# EAGLE design guhPLC_6LowPANModule (EAGLE 6.1)
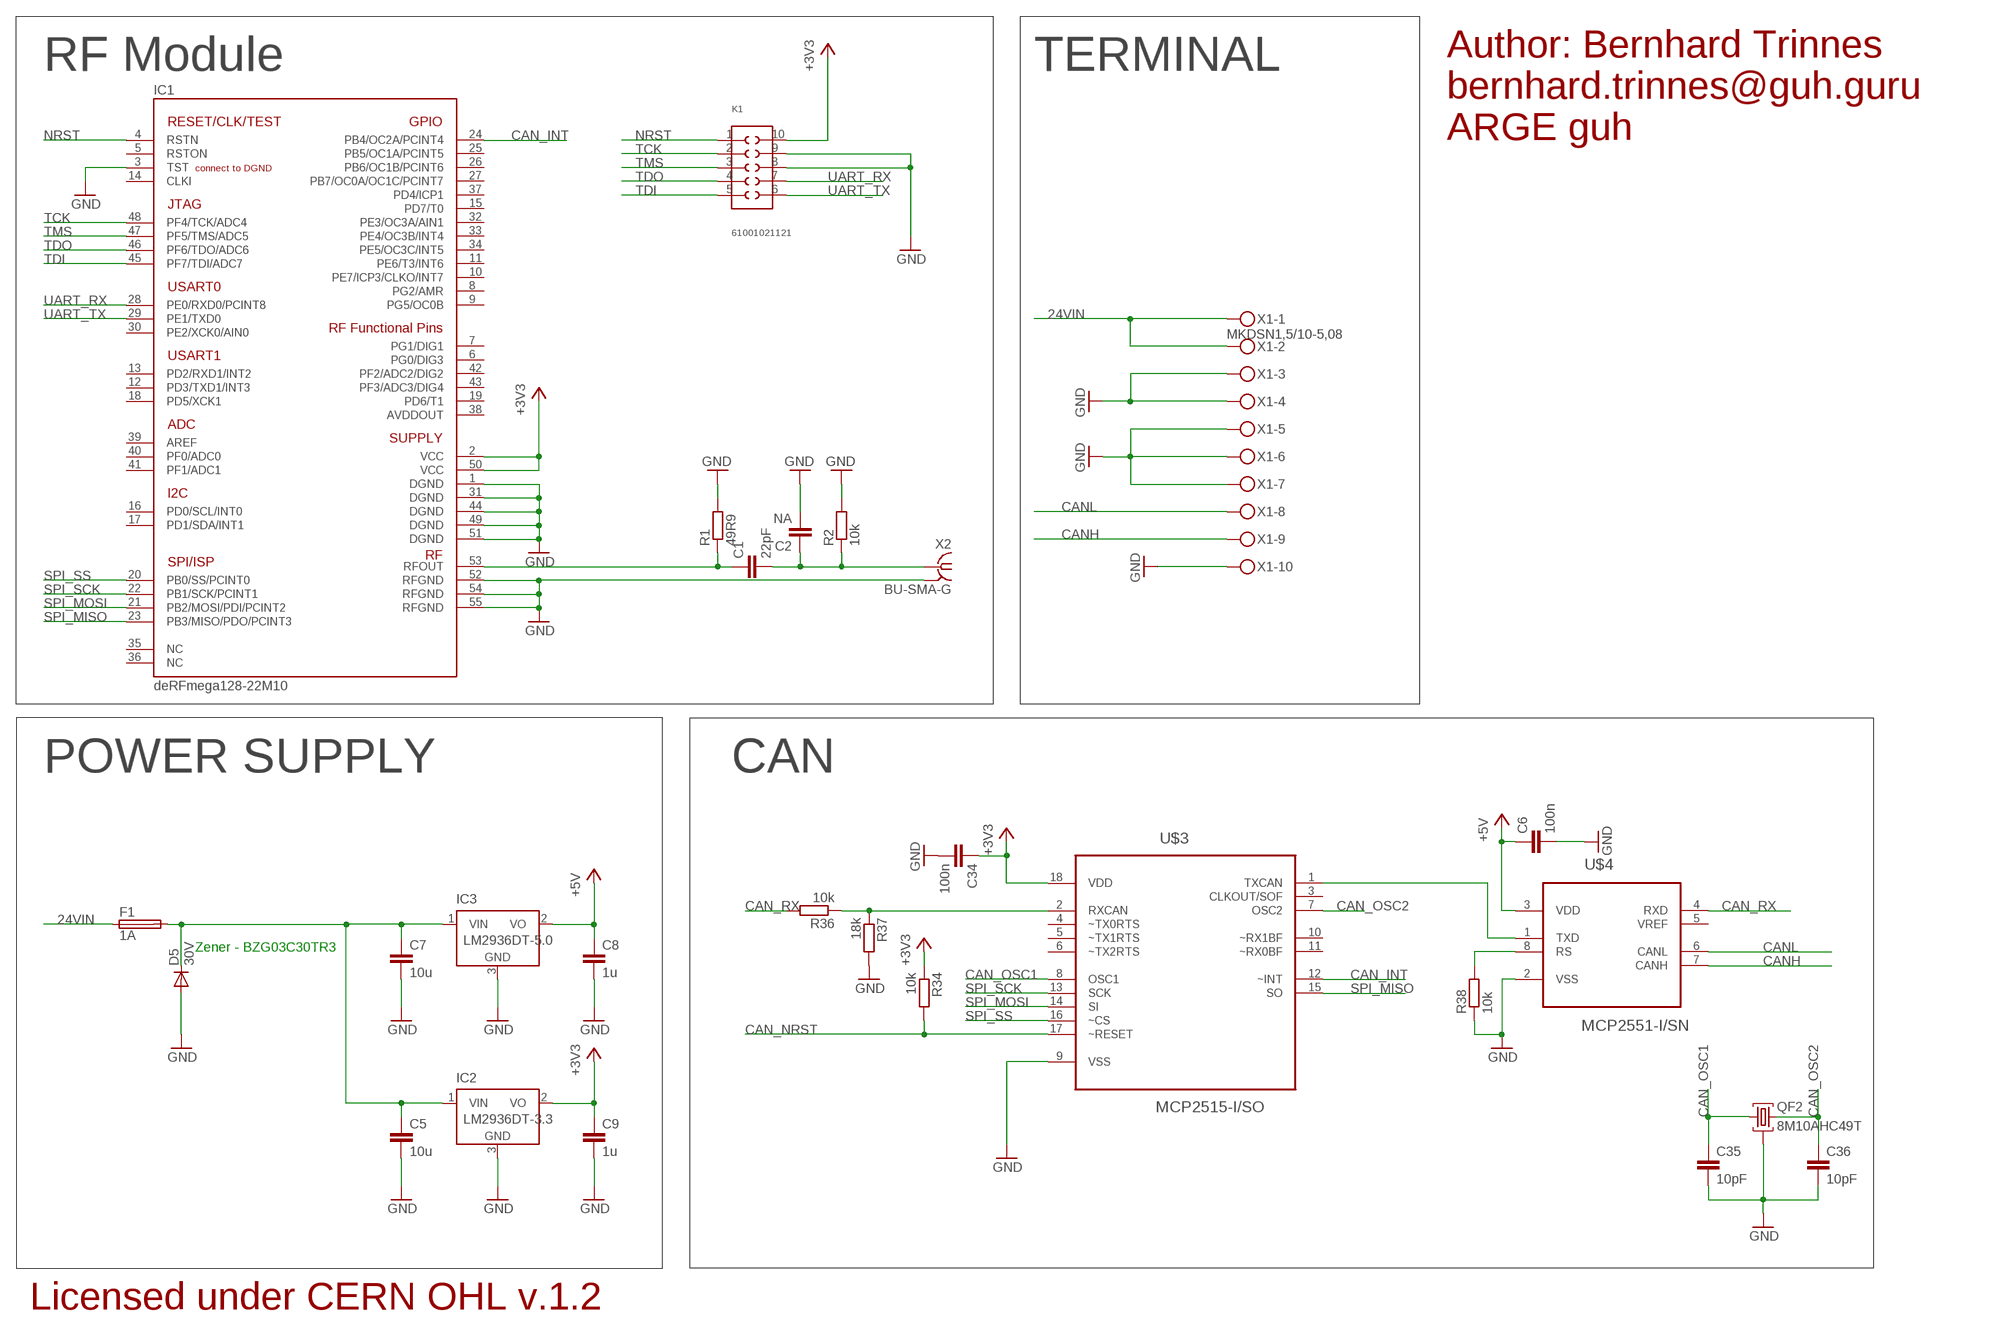
[diagram p0: schematic, sheet 1]

## Parts
C1  22pF  C-EUC0402  [C0402]
C2  NA  C-EUC0402  [C0402]
C5  10u  C-EUC1206  [C1206]
C6  100n  C-EUC0603  [C0603]
C7  10u  C-EUC1206  [C1206]
C8  1u  C-EUC0603  [C0603]
C9  1u  C-EUC0603  [C0603]
C34  100n  C-EUC0603  [C0603]
C35  10pF  C-EUC0603  [C0603]
C36  10pF  C-EUC0603  [C0603]
D5  30V  DIODE-DO214AC  [DO214AC]
F1  1A  LITTLEFUSE  [LITTLEFUSE]
IC1  DERFMEGA128-22M10  [A-M10]
IC2  LM2936DT-3.3  [TO252]
IC3  LM2936DT-5.0  [TO252]
K1  61001021121  [61001021121]
QF2  8M10AHC49T  [HC49U]
R1  49R9  R-EU_R0402  [R0402]
R2  10k  R-EU_R0402  [R0402]
R34  10k  R-EU_R0603  [R0603]
R36  10k  R-EU_R0603  [R0603]
R37  18k  R-EU_R0603  [R0603]
R38  10k  R-EU_R0603  [R0603]
U$3  MCP2515-I/SO  [SOIC127P1034X264-18N]
U$4  MCP2551-I/SN  [SOIC127P600X175-8N]
X1  MKDSN1,5/10-5,08  [MKDSN1,5/10-5,08]
X2  BU-SMA-G  [BU-SMA-G]

## Nets
24VIN: F1.1 X1.1 X1.2
+3V3: C9.1 C34.1 IC1.2(VCC) IC1.50(VCC) IC2.2(VO) K1.10 R34.1 U$3.18(VDD)
+5V: C6.1 C8.1 IC3.2(VO) U$4.3(VDD)
CAN_INT: IC1.24(PB4/OC2A/PCINT4) U$3.12(~INT)
CAN_NRST: R34.2 U$3.17(~RESET)
CAN_OSC1: C35.1 QF2.1 U$3.8(OSC1)
CAN_OSC2: C36.1 QF2.3 U$3.7(OSC2)
CAN_RX: R36.2 U$4.4(RXD)
CANH: U$4.7(CANH) X1.9
CANL: U$4.6(CANL) X1.8
GND [gnd]: C2.2 C5.2 C6.2 C7.2 C8.2 C9.2 C34.2 C35.2 C36.2 D5.A IC1.1(DGND) IC1.3(TST) IC1.31(DGND) IC1.44(DGND) IC1.49(DGND) IC1.51(DGND) IC1.52(RFGND) IC1.54(RFGND) IC1.55(RFGND) IC2.3(GND) IC3.3(GND) K1.8 K1.9 QF2.2 R1.2 R2.2 R37.2 R38.1 U$3.9(VSS) U$4.2(VSS) X1.3 X1.4 X1.5 X1.6 X1.7 X1.10 X2.2(GND)
N$1: C1.2 C2.1 R2.1 X2.1
N$20: U$3.1(TXCAN) U$4.1(TXD)
N$22: R36.1 R37.1 U$3.2(RXCAN)
N$24: R38.2 U$4.8(RS)
NRST: IC1.4(RSTN) K1.1
RFOUT: C1.1 IC1.53(RFOUT) R1.1
SPI_MISO: IC1.23(PB3/MISO/PDO/PCINT3) U$3.15(SO)
SPI_MOSI: IC1.21(PB2/MOSI/PDI/PCINT2) U$3.14(SI)
SPI_SCK: IC1.22(PB1/SCK/PCINT1) U$3.13(SCK)
SPI_SS: IC1.20(PB0/SS/PCINT0) U$3.16(~CS)
TCK: IC1.48(PF4/TCK/ADC4) K1.2
TDI: IC1.45(PF7/TDI/ADC7) K1.5
TDO: IC1.46(PF6/TDO/ADC6) K1.4
TMS: IC1.47(PF5/TMS/ADC5) K1.3
UART_RX: IC1.28(PE0/RXD0/PCINT8) K1.7
UART_TX: IC1.29(PE1/TXD0) K1.6
VCC [power]: C5.1 C7.1 D5.C F1.2 IC2.1(VIN) IC3.1(VIN)
Unconnected: IC1.5(RSTON) IC1.6(PG0/DIG3) IC1.7(PG1/DIG1) IC1.8(PG2/AMR) IC1.9(PG5/OC0B) IC1.10(PE7/ICP3/CLKO/INT7) IC1.11(PE6/T3/INT6) IC1.12(PD3/TXD1/INT3) IC1.13(PD2/RXD1/INT2) IC1.14(CLKI) IC1.15(PD7/T0) IC1.16(PD0/SCL/INT0) IC1.17(PD1/SDA/INT1) IC1.18(PD5/XCK1) IC1.19(PD6/T1) IC1.25(PB5/OC1A/PCINT5) IC1.26(PB6/OC1B/PCINT6) IC1.27(PB7/OC0A/OC1C/PCINT7) IC1.30(PE2/XCK0/AIN0) IC1.32(PE3/OC3A/AIN1) IC1.33(PE4/OC3B/INT4) IC1.34(PE5/OC3C/INT5) IC1.35(NC) IC1.36(NC) IC1.37(PD4/ICP1) IC1.38(AVDDOUT) IC1.39(AREF) IC1.40(PF0/ADC0) IC1.41(PF1/ADC1) IC1.42(PF2/ADC2/DIG2) IC1.43(PF3/ADC3/DIG4) U$3.3(CLKOUT/SOF) U$3.4(~TX0RTS) U$3.5(~TX1RTS) U$3.6(~TX2RTS) U$3.10(~RX1BF) U$3.11(~RX0BF) U$4.5(VREF)

## Notes on the sheet
- Author: Bernhard Trinnes
- RF Module | TERMINAL
- bernhard.trinnes@guh.guru
- ARGE guh
- POWER SUPPLY | CAN
- Zener - BZG03C30TR3
- Licensed under CERN OHL v.1.2

## Power pins joined to a net without a drawn wire
GND: X2.3(GND) X2.4(GND) X2.5(GND)

## Library data of the parts
C1 C2 C5-C9 C34-C36 = resistor:C-EU: CAPACITOR, European symbol
D5 = diode:DIODE-: DIODE
F1 = fuse:LITTLEFUSE: LITTLEFUSE Picofuse/slow Littlefuse; OC_FARNELL: unknown; OC_NEWARK: unknown
IC1 = deRFmodules:DERFMEGA128-22M10: deRFmega128 IEEE 802.15.4 Low Power Wireless Radio Module Microcontroller: Atmel ATmega128RFA1 Transceiver: integrated Manufacturer: dresden elektronik ingenieurtechnik gmbh Website: http://www.dresden-elektronik.de
IC2 = national-semiconductor:LM2936?*: Ultra-Low Quiescent Current LDO Voltage Regulator Source: Data sheet <http://www.national.com/ds/LM/LM2936.pdf>; MPN: LM2936DT-3.3.; OC_FARNELL: 1286863; OC_NEWARK: 26M0361
IC3 = national-semiconductor:LM2936?*: Ultra-Low Quiescent Current LDO Voltage Regulator Source: Data sheet <http://www.national.com/ds/LM/LM2936.pdf>; MF: NATIONAL SEMICONDUCTOR; MPN: LM2936DT-5.0/NOPB; OC_FARNELL: 1286864; OC_NEWARK: 41K4501
K1 = EagleLibrary_Wuerth_Elektronik_eiCan_Board_to_Board_Connectors_v6_20150113:61001021121: WR-PHD 2.54mm Dual SMT Pin Header, 10 Pins =>Code : Con_BTB_PHD_2.54_2_61001021121 <http://katalog.we-online.de/media/images/eican/Con_BTB_PHD_2.54_2_6100xx21121_pf2.jpg> Details see: http://katalog.we-online.de/en/em/610_0xx_211_21 Created 2014-05-29, Karrer Zheng 2014 (C) Würth Elektronik
QF2 = crystal:8M10AHC49T: Monolithic Crystal Filters Source: www.vanlong.com; OC_FARNELL: unknown; OC_NEWARK: unknown
R1 R2 R34 R36-R38 = resistor:R-EU_: RESISTOR, European symbol
U$3 = guh:MCP2515-I/SO: CAN Controller; MPN: MCP2515-I/SO; OC_FARNELL: 1292239; OC_NEWARK: 29H7136; PACKAGE: SOIC-18; SUPPLIER: Microchip
U$4 = guh:MCP2551-I/SN: High-Speed CAN Transceiver; MPN: MCP2551-I/SN; OC_FARNELL: 9758569; OC_NEWARK: 69K7604; PACKAGE: SOIC-8; SUPPLIER: Microchip
X1 = con-phoenix-508:MKDSN1,5/10-5,08: MKDSN 1,5/10-5,08 Printklemme Nennstrom: 13,5 A Nennspannung: 250 V Rastermaß: 5,08 mm Polzahl: 10 Anschlussart: Schraubanschluss Montage: Löten Anschlussrichtung Leiter/Platine: 0 ° Artikelnummer: 1729209 Source: http://eshop.phoenixcontact.com .. 1729209.pdf; MPN: SMKDSN1,5/10-5,08; OC_FARNELL: 1792913; OC_NEWARK: 70R0297
X2 = con-coax:BU-SMA-G: FEMALE SMA CONNECTOR Radiall distributor RS 193-9117; OC_FARNELL: unknown; OC_NEWARK: unknown

## Net classes
0 default: width 0.254 mm, clearance 0.254 mm
1 power: width 0.61 mm, drill 0.61 mm, clearance 0.254 mm
2 gnd: width 0.305 mm, drill 0.559 mm, clearance 0.254 mm

## Board
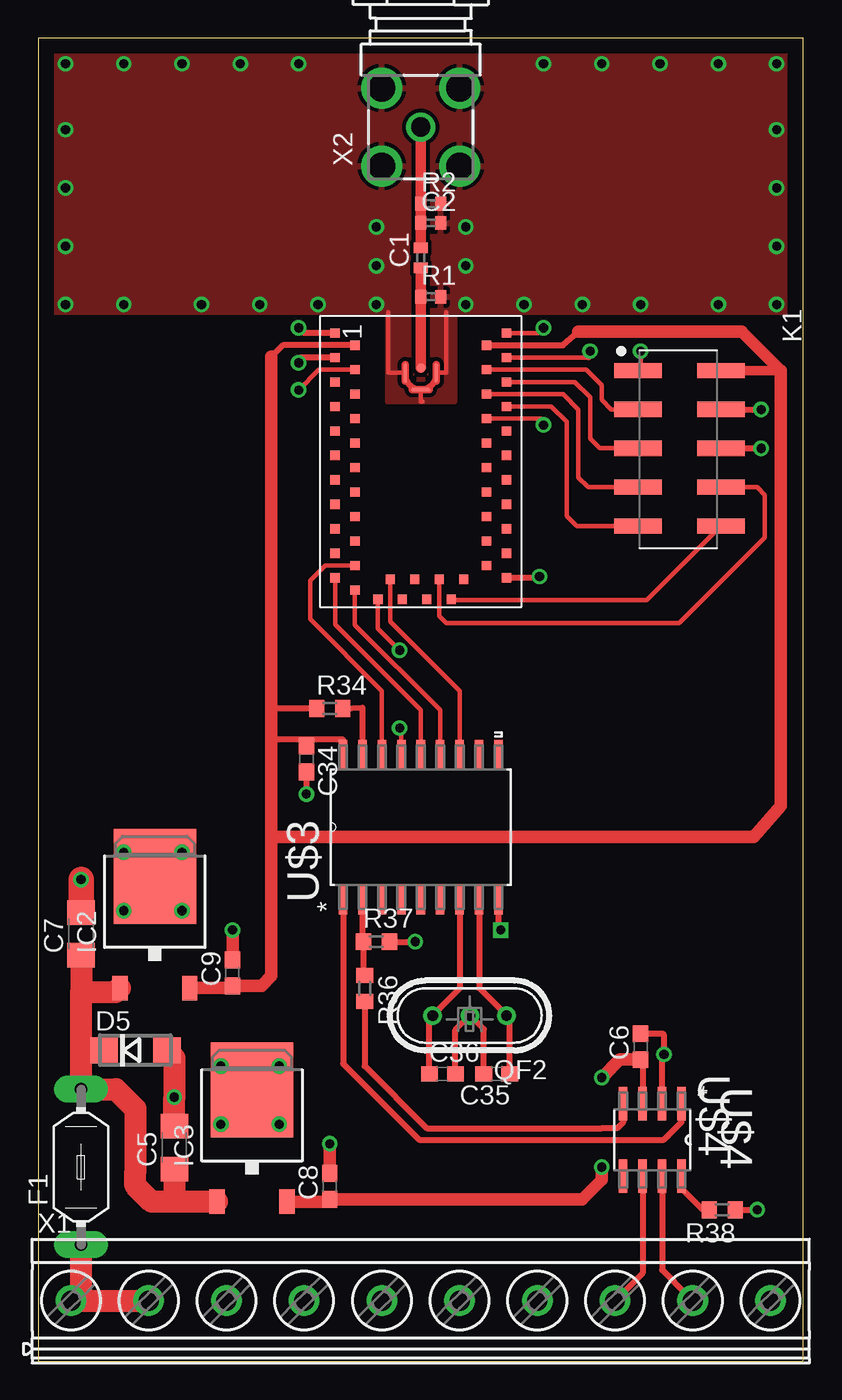
[diagram p1: board, top side]
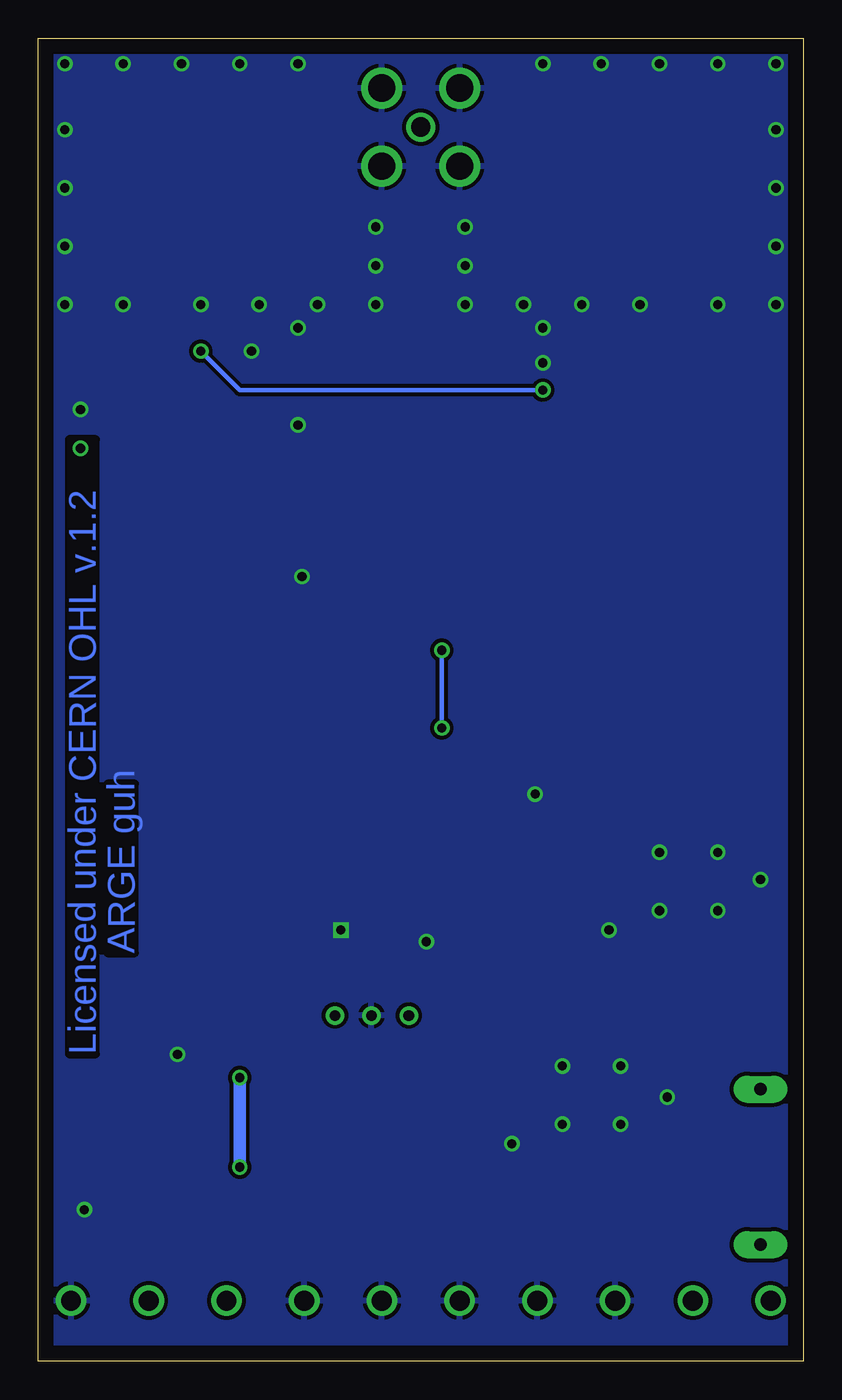
[diagram p2: board, bottom side, seen from below]

Size 50 x 86.5 mm. Coordinates in mm from the lower left corner, seen from the top.
Outline: 0,0 50,0 50,86.5 0,86.5 0,0
Copper layers (1*16): Top 0.035mm / dielectric 1.5mm / Bottom 0.035mm
Design rules: minimum track width 10mil, minimum drill 24mil, track to track 8mil, track to pad 8mil, pad to pad 8mil, via to via 8mil, smd to smd 8mil, copper to edge 40mil, drill to drill 8mil, minimum pad ring 10mil, minimum via ring 8mil, stop-mask expansion 4mil, vias tented up to drill 0mil, thermal gap 10mil

### Footprints (pad centres in the part's own frame; a part is rotated, then mirrored left to right if it is on the bottom)
C0402 = smd 0.7 x 0.9: 1 -0.65,0; 2 0.65,0
C1206 = smd 1.6 x 1.8: 1 -1.4,0; 2 1.4,0
C0603 = smd 1.1 x 1: 1 -0.85,0; 2 0.85,0
DO214AC = smd 1.8 x 1.7: A 2.05,0; C -2.05,0
LITTLEFUSE = drill 0.813 pad 1.778 long: 1 -5.08,0; 2 5.08,0
A-M10 = smd 0.6 x 0.6: 1 -8.4,-5.6; 2 -7.6,-4.3; 3 -6.8,-5.6; 4 -6,-4.3; 5 -5.2,-5.6; 6 -4.4,-4.3; 7 -3.6,-5.6; 8 -2.8,-4.3; 9 -2,-5.6; 10 -1.2,-4.3; 11 -0.4,-5.6; 12 0.4,-4.3; 13 1.2,-5.6; 14 2,-4.3; 15 2.8,-5.6; 16 3.6,-4.3; 17 4.4,-5.6; 18 5.2,-4.3; 19 6,-5.6; 20 6.8,-4.3; 21 7.6,-5.6; 22 8.4,-4.3; 23 9,-2.8; 24 7.7,-2; 25 9,-1.2; 26 7.7,-0.4; 27 9,0.4; 28 7.7,1.2; 29 9,2; 30 7.7,2.8; 31 7.6,5.6; 32 6.8,4.3; 33 6,5.6; 34 5.2,4.3; 35 4.4,5.6; 36 3.6,4.3; 37 2.8,5.6; 38 2,4.3; 39 1.2,5.6; 40 0.4,4.3; 41 -0.4,5.6; 42 -1.2,4.3; 43 -2,5.6; 44 -2.8,4.3; 45 -3.6,5.6; 46 -4.4,4.3; 47 -5.2,5.6; 48 -6,4.3; 49 -6.8,5.6; 50 -7.6,4.3; 51 -8.4,5.6; 53 -6.14,0 | smd 1.3 x 0.2: 52 -5.8,1; 54 -5.8,-1 | smd 0.2 x 1.3: 55 -4.7,0
TO252 = smd 1 x 1.6: 1 -2.28,-4.8; 2 2.28,-4.8 | smd 5.4 x 6.2: 3 0,2.5
61001021121 = smd 1 x 3.1: 1 -3.81,-2.7; 2 -1.27,-2.7; 3 1.27,-2.7; 4 3.81,-2.7; 5 6.35,-2.7; 6 6.35,2.7; 7 3.81,2.7; 8 1.27,2.7; 9 -1.27,2.7; 10 -3.81,2.7
HC49U = drill 0.7 pad 1.2: 1 -2.413,0; 2 -0.027,0; 3 2.413,0
R0402 = smd 0.7 x 0.9: 1 -0.65,0; 2 0.65,0
R0603 = smd 1 x 1.1: 1 -0.85,0; 2 0.85,0
SOIC127P1034X264-18N = smd 1.981 x 0.559: 1 -4.699,5.08; 2 -4.699,3.81; 3 -4.699,2.54; 4 -4.699,1.27; 5 -4.699,0; 6 -4.699,-1.27; 7 -4.699,-2.54; 8 -4.699,-3.81; 9 -4.699,-5.08; 10 4.699,-5.08; 11 4.699,-3.81; 12 4.699,-2.54; 13 4.699,-1.27; 14 4.699,0; 15 4.699,1.27; 16 4.699,2.54; 17 4.699,3.81; 18 4.699,5.08
SOIC127P600X175-8N = smd 2.184 x 0.559: 1 -2.362,1.905; 2 -2.362,0.635; 3 -2.362,-0.635; 4 -2.362,-1.905; 5 2.362,-1.905; 6 2.362,-0.635; 7 2.362,0.635; 8 2.362,1.905
MKDSN1,5/10-5,08 = drill 1.3 pad 2: 1 -22.881,0.025; 2 -17.801,0.025; 3 -12.721,0.025; 4 -7.641,0.025; 5 -2.561,0.025; 6 2.519,0.025; 7 7.599,0.025; 8 12.679,0.025; 9 17.759,0.025; 10 22.839,0.025
BU-SMA-G = drill 1.27: 1 0,0 | drill 1.778: 2 -2.55,2.55; 3 2.55,2.55; 4 2.55,-2.55; 5 -2.55,-2.55

### Placement (x,y rotation side)
C1  25,72.14 90 top
C2  25.65,74.42 0 top
C5  8.89,13.97 90 top
C6  39.37,20.57 90 top
C7  2.79,27.94 90 top
C8  19.05,11.43 90 top
C9  12.7,25.4 90 top
C34  17.53,39.37 270 top
C35  29.97,18.8 180 top
C36  26.42,18.8 0 top
D5  6.35,20.32 0 top
F1  2.79,12.7 90 top
IC1  25,58.82 270 top
IC2  7.62,29.21 0 top
IC3  13.97,15.24 0 top
K1  41.91,60.96 270 top
QF2  28.19,22.61 180 top
R1  25.65,69.6 0 top
R2  25.65,75.69 0 top
R34  19.05,42.67 0 top
R36  21.34,24.38 270 top
R37  22.1,27.43 0 top
R38  44.7,9.91 180 top
U$3  25,34.92 90 top
U$4  40.13,14.48 270 top
X1  25.02,3.94 0 top
X2  25,80.69 90 top

### Tracks (layer width: path | path; a pad name or v marks a point on that pad's centre or on a via)
24VIN
  Top 1.422: X1.2 X1.1 2.79,4.36 F1.1
+3V3
  Top 0.406: IC1.2 15.99,66.42 15.24,65.68 | 29.21,34.29 29.72,34.29 | C34.1 17.11,40.64 | 17.11,40.64 15.24,40.64 | U$3.18 19.92,40.64 17.11,40.64 | IC1.50 34.29,66.42 35.31,67.31 | R34.1 15.24,42.67
  Top 0.61: K1.10 48.51,64.77
  Top 0.813: 15.24,65.68 15.24,42.67 15.24,40.64 15.24,34.29 | 15.24,34.29 29.21,34.29 46.77,34.29 48.51,36.29 48.51,64.77 45.97,67.31 35.31,67.31 | IC2.2 12.7,24.41 C9.1 14.61,24.55 15.24,25.18 15.24,34.29
+5V  (via drill 0.6)
  Top 0.406: C6.1 arc-90 39.5,19.6 U$4.3
  Top 0.813: IC3.2 19.05,10.44 C8.1 35.56,10.58 36.83,11.85 v36.83,12.7 | v36.83,18.54 38.01,19.72 C6.1
  Bottom 0.813: v36.83,12.7 v36.83,18.54
CAN_INT
  Top 0.305: IC1.24 23,48.37 27.54,43.83 U$3.12
CAN_NRST
  Top 0.406: R34.2 21.19,42.73 U$3.17
CAN_OSC1
  Top 0.406: C35.1 30.82,22.39 QF2.1 28.81,24.4 U$3.8
CAN_OSC2
  Top 0.406: C36.1 25.57,22.39 QF2.3 27.54,24.36 U$3.7
CAN_RX
  Top 0.406: R36.2 21.34,19.3 25.4,15.24 36.83,15.24 37.85,15.24 38.23,15.62 U$4.4
CANH
  Top 0.406: U$4.7 40.77,5.97 42.42,4.32 | 42.42,4.32 42.67,4.06 | X1.9 42.42,4.32
CANL
  Top 0.406: U$4.6 39.5,5.76 X1.8
GND  (via drill 0.6)
  Top 0.3: IC1.54 22.86,64.62 22.86,68.58 | IC1.52 26.67,64.62 26.67,68.58 | IC1.55 25,62.74 25.15,62.74
  Top 0.305: IC1.44 32.86,61.62 v33.02,61.21 | IC1.51 32.68,67.22 v33.02,67.56 | IC1.49 35.98,65.62
  Top 0.406: U$3.9 30.08,28.34 | 30.08,28.34 v30.23,28.19 30.08,28.34 | U$4.2 40.77,19.94 v40.89,20.07 40.89,21.34 40.81,21.42 C6.2 | R38.1 v46.99,9.91 | IC1.31 32.17,51.22 v32.77,51.31 | C34.2 v17.53,37.08 | R37.2 v24.64,27.43 | C35.2 29.12,21.7 QF2.2 27.27,21.65 C36.2 | IC1.3 17.11,65.62 v17.02,65.28 | IC1.1 17.36,67.22 v17.02,67.56 | 35.98,65.62 v36.07,66.04 | K1.8 v47.24,59.69 | K1.9 v47.24,62.23
  Top 0.813: C8.2 v19.05,14.22 | v15.75,19.3 13.97,19.3 IC3.3 | C9.2 v12.7,28.19 | v9.4,33.27 7.62,33.27 IC2.3
  Top 1.422: C5.2 v8.89,17.27 8.89,19.83 D5.A
  Top 1.676: C7.2 v2.79,31.5
  other vias: 15.75,15.49 1.78,84.84 5.59,84.84 9.4,84.84 13.21,84.84 17.02,84.84 48.26,84.84 44.45,84.84 40.64,84.84 36.83,84.84 33.02,84.84 1.78,69.09 5.59,69.09 48.26,69.09 44.45,69.09 27.94,74.17 27.94,71.63 27.94,69.09 22.1,74.17 22.1,71.63 22.1,69.09 18.29,69.09 1.78,80.52 1.78,72.9 10.67,69.09 14.48,69.09 31.75,69.09 35.56,69.09 39.37,69.09 48.26,76.71 48.26,80.52 1.78,76.71 48.26,72.9 11.94,19.3 11.94,15.49 5.59,29.46 9.4,29.46 5.59,33.27
  pour Bottom (rank 6): -3.81,90.17 54.61,90.17 54.61,-7.62 -3.81,-7.62
  pour Top (isolate 0.2): -1.27,87.63 50.8,87.63 52.07,68.58 0,68.58
  pour Top (isolate 0.2, rank 6): 22.86,68.58 27.18,68.58 27.18,62.74 22.86,62.74
N$1
  Top 0.5: X2.1 arc-90 X2.1 | C2.1 arc90 25,73.91
  Top 0.7: X2.1 R2.1 C2.1 | 25,73.91 C1.2
N$20
  Top 0.406: U$3.1 19.92,19.45 24.89,14.48 37.59,14.48 40.89,14.48 41.15,14.73 42.04,15.62 U$4.1
N$22
  Top 0.406: U$3.2 21.19,27.43 R37.1 21.25,25.23 R36.1
N$24
  Top 0.406: R38.2 43.43,9.91 42.16,11.18 42.04,11.3 U$4.8
NRST  (via drill 0.6)
  Top 0.305: IC1.4 18.34,64.82 v17.02,63.5 | v39.37,66.04 39.37,64.93
  Top 0.406: 39.37,64.93 K1.1
  Bottom 0.305: v17.02,63.5 36.83,63.5 v39.37,66.04
RFOUT
  Top 0.5: R1.1 arc90 25,69.08 | C1.1
  Top 0.7: 25,69.08 IC1.53 | R1.1 C1.1
SPI_MISO  (via drill 0.6)
  Top 0.305: IC1.23 22.2,47.9 v23.62,46.48 | 23.73,41.29 U$3.15
  Top 0.406: v23.62,41.4 23.73,41.29
  Bottom 0.305: v23.62,46.48 v23.62,41.4
SPI_MOSI
  Top 0.305: IC1.21 19.4,48.16 25,42.56 U$3.14
SPI_SCK
  Top 0.305: IC1.22 20.7,48.13 26.27,42.56 U$3.13
SPI_SS
  Top 0.305: IC1.20 18.75,52.02 17.78,51.05 17.78,48.51 22.46,43.83 U$3.16
TCK
  Top 0.305: IC1.48 35.83,64.82 36.83,63.82 36.83,63.5 36.83,62.87 37.47,62.23 K1.2
TDI
  Top 0.305: IC1.45 33.54,62.42 34.54,61.42 34.54,56.39 34.54,55.24 35.18,54.61 K1.5
TDO
  Top 0.305: IC1.46 34.31,63.22 35.31,62.22 35.31,58.67 35.31,57.78 35.94,57.15 K1.4
TMS
  Top 0.305: IC1.47 35.07,64.02 36.07,63.02 36.07,60.96 36.07,60.33 36.7,59.69 K1.3
UART_RX
  Top 0.305: IC1.28 26.2,48.73 26.67,48.26 41.91,48.26 47.5,53.85 47.5,56.64 46.99,57.15 44.7,57.15 K1.7
UART_TX
  Top 0.305: K1.6 39.78,49.78 26.92,49.78
  Top 0.406: 26.92,49.78 26.96,49.82 IC1.29
VCC
  Top 1.422: 2.79,20.32 F1.2 5.08,17.78 6.35,16.51 6.35,12.45 6.35,11.48 7.39,10.44 8.89,10.44 | 2.79,20.32 2.79,24.13 | D5.C 2.79,20.32 | IC3.1 8.89,10.44 | C5.1 8.89,10.44 | IC2.1 5.06,24.13 2.79,24.13 | C7.1 2.79,26.29 2.79,24.13

### Text on the board
Bottom: ARGE guh | Licensed under CERN OHL v.1.2
tDocu: Author: Bernhard Trinnes | bernhard.trinnes@guh.guru